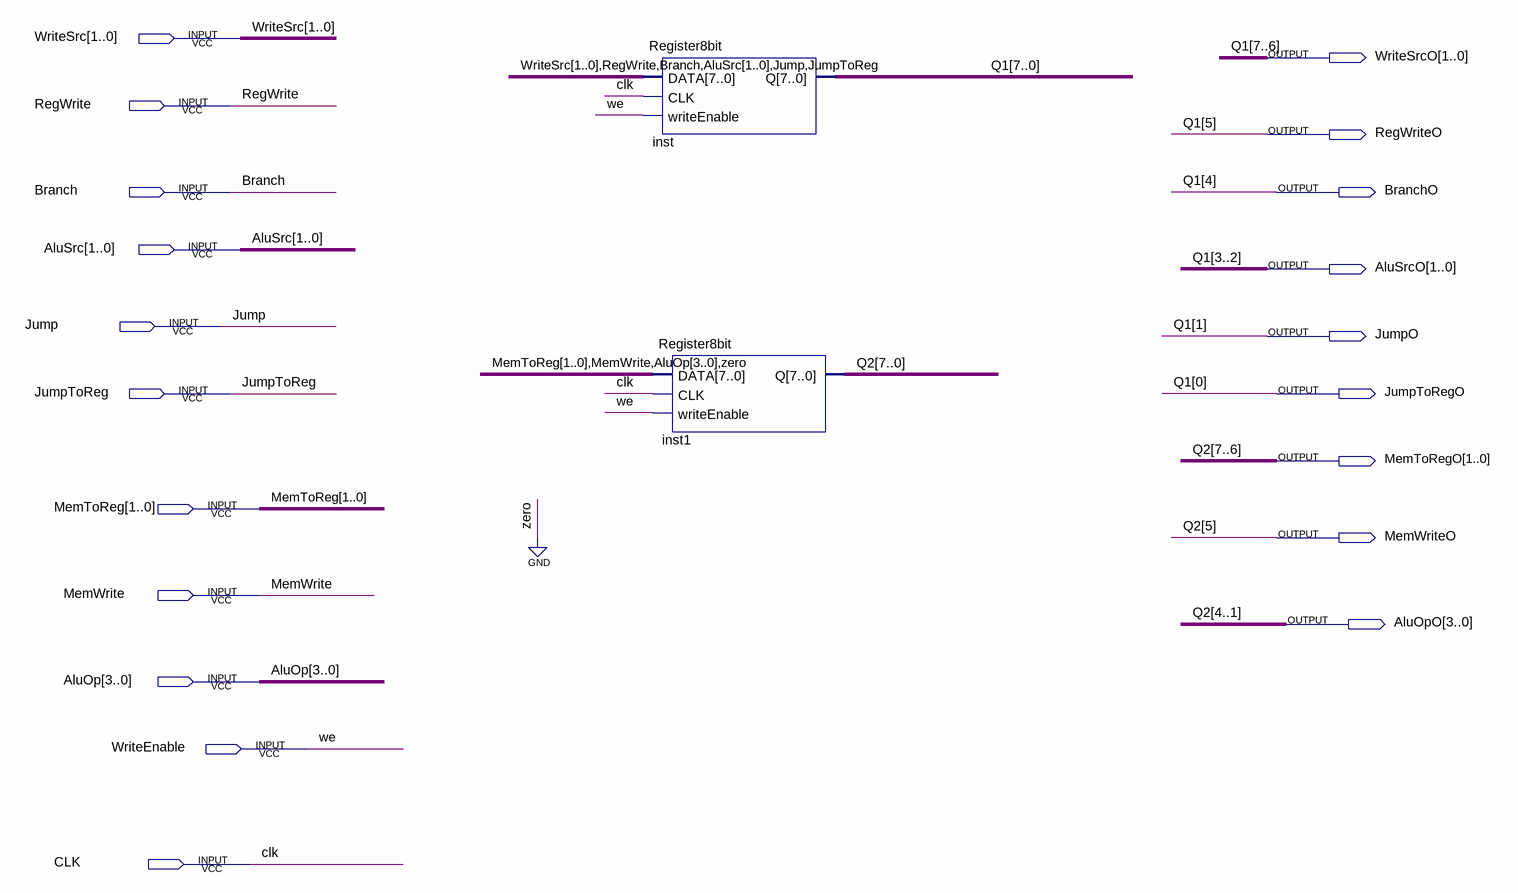
[diagram p0: schematic sheet]
// Quartus schematic controlRegister.bdf as structural Verilog: 2 symbols, 20 pins
module controlRegister (
  input  [1:0] WriteSrc,
  input  RegWrite,
  input  Branch,
  input  [1:0] AluSrc,
  input  Jump,
  input  JumpToReg,
  input  [1:0] MemToReg,
  input  MemWrite,
  input  [3:0] AluOp,
  input  WriteEnable,
  input  CLK,
  output [1:0] WriteSrcO,
  output RegWriteO,
  output BranchO,
  output [1:0] AluSrcO,
  output JumpO,
  output JumpToRegO,
  output [1:0] MemToRegO,
  output MemWriteO,
  output [3:0] AluOpO
);

  wire [0:0] Q2;

  Register8bit inst (
    .DATA({WriteSrc, RegWrite, Branch, AluSrc, Jump, JumpToReg}), .CLK(CLK), .writeEnable(WriteEnable),
    .Q({WriteSrcO, RegWriteO, BranchO, AluSrcO, JumpO, JumpToRegO}));
  Register8bit inst1 (
    .DATA({MemToReg, MemWrite, AluOp, 1'b0}), .CLK(CLK), .writeEnable(WriteEnable),
    .Q({MemToRegO, MemWriteO, AluOpO, Q2[0]}));

  // Other names for the same wires on the sheet: Q1[7:0] = {WriteSrcO, RegWriteO, BranchO, AluSrcO, JumpO, JumpToRegO};
  //   Q2[7:1] = {MemToRegO, MemWriteO, AluOpO}; we = WriteEnable
endmodule
